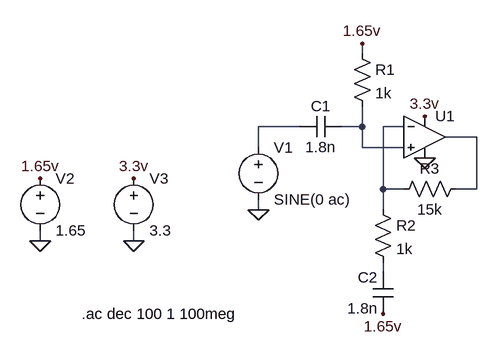
[diagram p0: schematic Draft3.asc]
Draft3.asc, the LTspice schematic file:
Version 4
SHEET 1 880 680
WIRE 320 48 320 32
WIRE 224 160 160 160
WIRE 320 160 320 128
WIRE 320 160 288 160
WIRE 384 160 352 160
WIRE 496 176 448 176
WIRE 160 192 160 160
WIRE 320 192 320 160
WIRE 384 192 320 192
WIRE 352 256 352 160
WIRE 384 256 352 256
WIRE 496 256 496 176
WIRE 496 256 464 256
WIRE 160 288 160 272
WIRE 352 288 352 256
WIRE -176 336 -176 320
WIRE -32 336 -32 320
WIRE 352 384 352 368
FLAG 160 288 0
FLAG -176 336 0
FLAG 416 208 0
FLAG 416 144 3.3v
FLAG -32 240 3.3v
FLAG 320 32 1.65v
FLAG -176 240 1.65v
FLAG -32 336 0
FLAG 352 448 1.65v
SYMBOL res 304 32 R0
SYMATTR InstName R1
SYMATTR Value 1k
SYMBOL res 336 272 R0
SYMATTR InstName R2
SYMATTR Value 1k
SYMBOL res 480 240 R90
WINDOW 0 0 56 VBottom 2
WINDOW 3 32 56 VTop 2
SYMATTR InstName R3
SYMATTR Value 15k
SYMBOL cap 288 144 R90
WINDOW 0 0 32 VBottom 2
WINDOW 3 32 32 VTop 2
SYMATTR InstName C1
SYMATTR Value 1.8n
SYMBOL cap 368 448 R180
WINDOW 0 24 56 Left 2
WINDOW 3 24 8 Left 2
SYMATTR InstName C2
SYMATTR Value 1.8n
SYMBOL voltage 160 176 R0
WINDOW 123 0 0 Left 0
WINDOW 39 0 0 Left 0
SYMATTR InstName V1
SYMATTR Value SINE(0 ac)
SYMBOL voltage -176 224 R0
WINDOW 123 0 0 Left 0
WINDOW 39 0 0 Left 0
SYMATTR InstName V2
SYMATTR Value 1.65
SYMBOL OpAmps\\UniversalOpAmp2 416 176 R0
SYMATTR InstName U1
SYMATTR Value2 Avol=1Meg GBW=20Meg Slew=10Meg
SYMBOL voltage -32 224 R0
WINDOW 123 0 0 Left 0
WINDOW 39 0 0 Left 0
SYMATTR InstName V3
SYMATTR Value 3.3
TEXT -112 448 Left 2 !.ac dec 100 1 100meg

The netlist it stands for:
* Draft3.asc
R1 1.65v N002 1k
R2 N003 N005 1k
R3 N004 N003 15k
C1 N002 N001 1.8n
C2 1.65v N005 1.8n
V1 N001 0 SINE(0 ac)
V2 1.65v 0 1.65
XU1 N002 N003 3.3v 0 N004 level2 Avol=1Meg GBW=20Meg Slew=10Meg Ilimit=25m Rail=0 Vos=0 En=0 Enk=0 In=0 Ink=0 Rin=500Meg  ; pins In+ In- V+ V- OUT
V3 3.3v 0 3.3
.ac dec 100 1 100meg
.lib UniversalOpAmp2.lib
.backanno
.end